# EAGLE design schem2 (EAGLE 9.6.2)
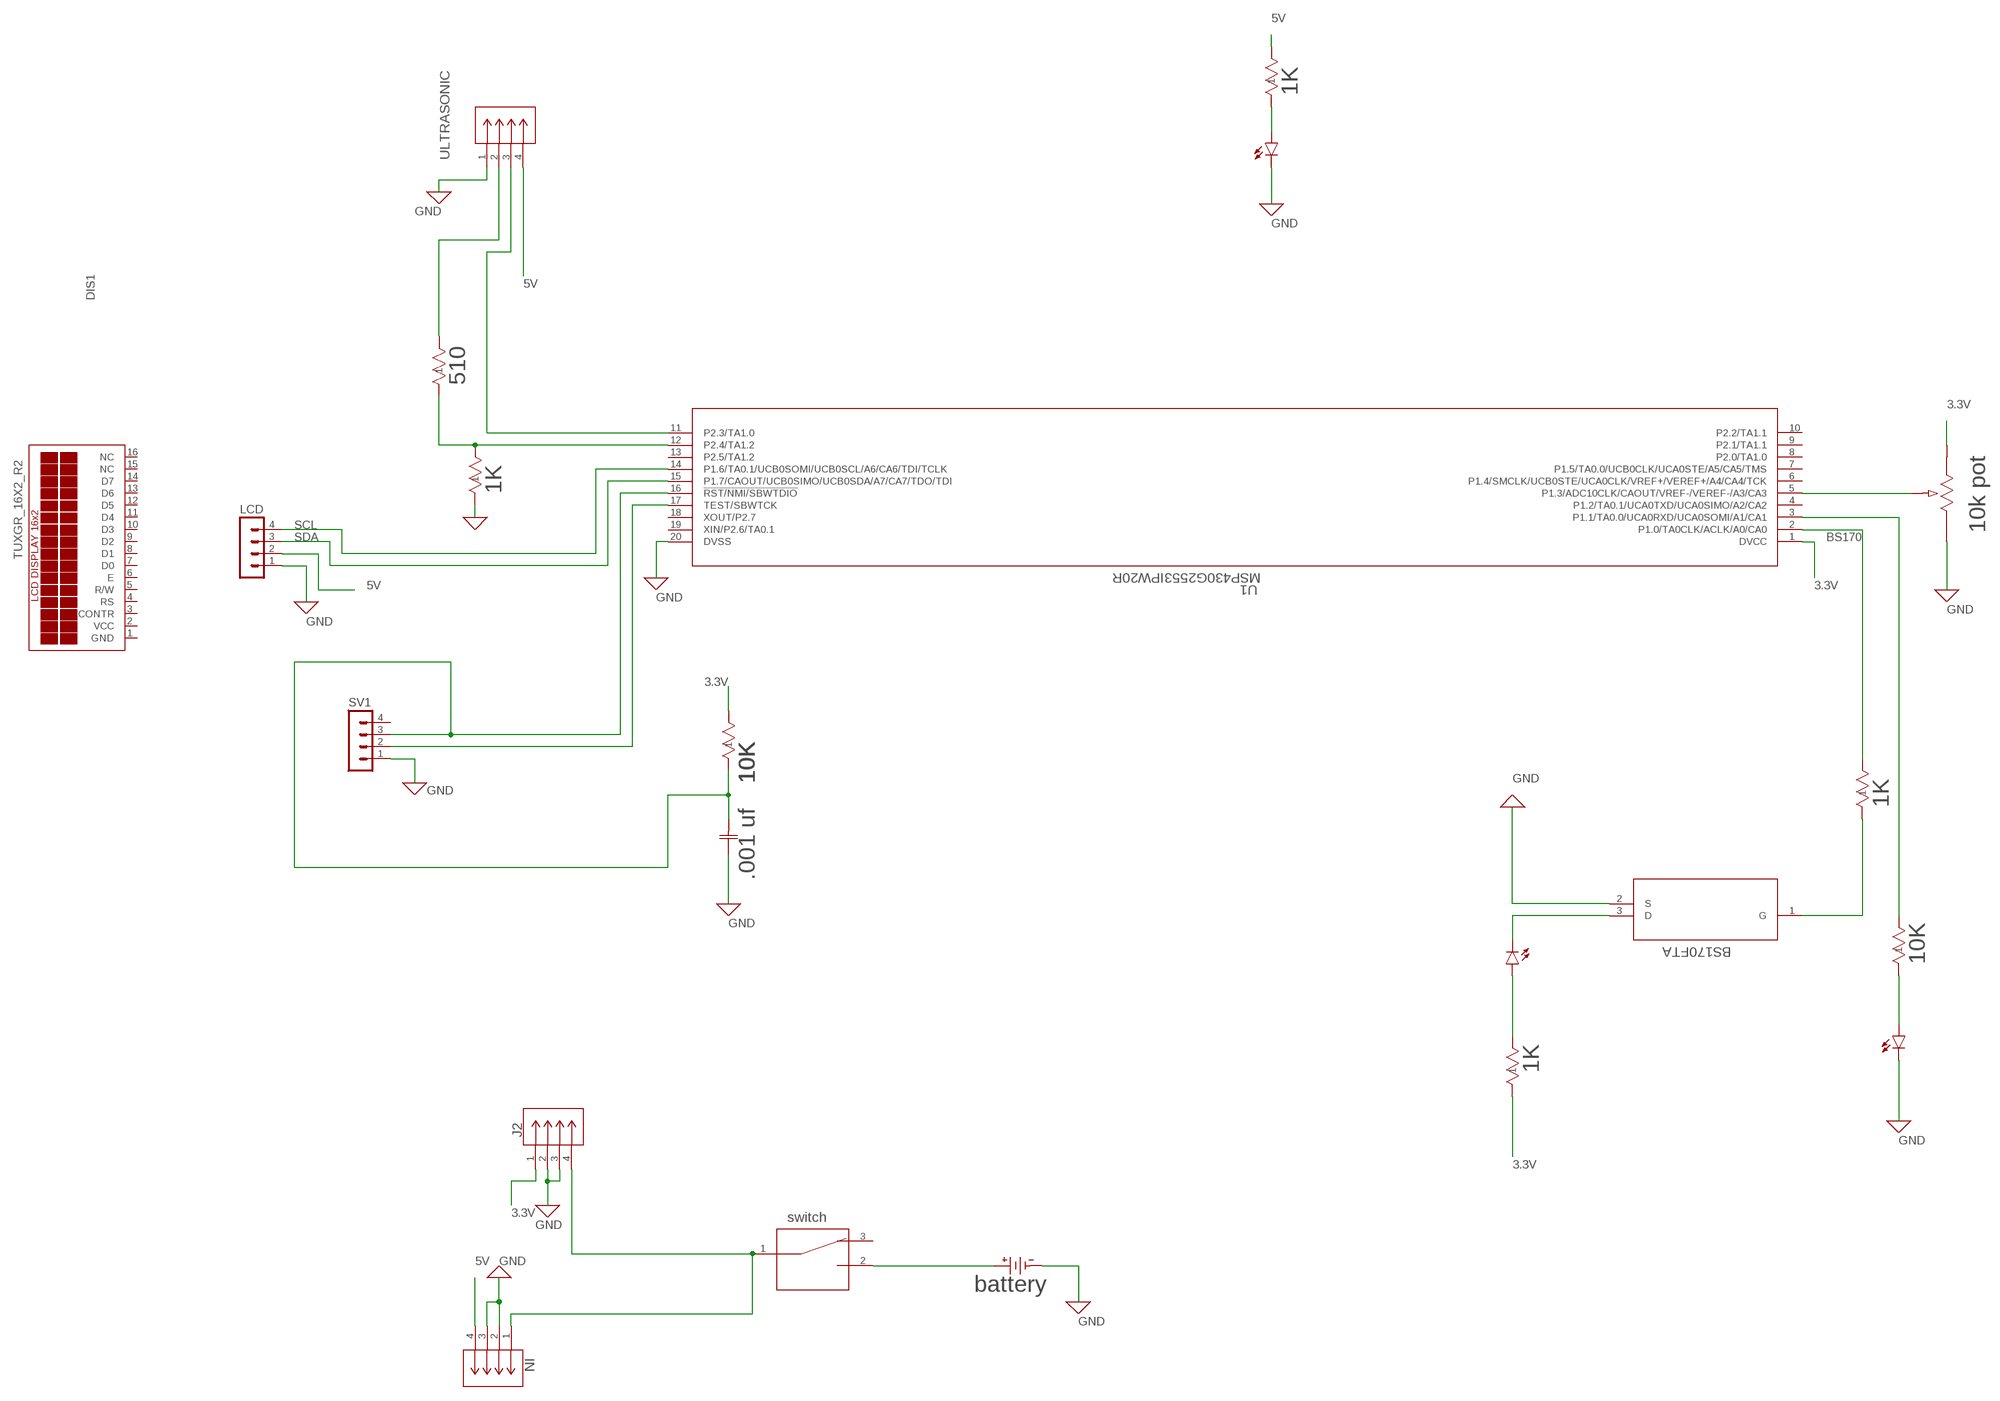
[diagram p0: schematic, sheet 1]

## Parts
B1  battery  2462RB  [2462RB_KEY]
C1  .001 uf  1206B473K500CT  [CAP_1206_B_WAL]
DIS1  TUXGR_16X2_R2  [TUXGR_16X2_R2]
IN  SSW-104-01-T-S  [CON4_1X4_TU_SSQ]
J2  SSW-104-01-T-S  [CON4_1X4_TU_SSQ]
LCD  MA04-1  [MA04-1]
LED1  LEDCHIPLED_0805  [CHIPLED_0805]
LED2  LEDCHIPLED_0805  [CHIPLED_0805]
LED5R  LEDCHIPLED_0805  [CHIPLED_0805]
R1  510  RMCF1206JT510R  [STA_RMCF1206_STP]
R2  10K  RC1206FR-0710KL  [RC1206N_YAG]
R3  1K  RC1206FR-071KL  [RES_RC1206_YAG]
R4  10k pot  3362P-1-103LF  [POT_3362P]
R5REG  1K  RC1206FR-071KL  [RES_RC1206_YAG]
R6  1K  RC1206FR-071KL  [RES_RC1206_YAG]
R7  1K  RC1206FR-071KL  [RES_RC1206_YAG]
R8  10K  RC1206FR-0710KL  [RC1206N_YAG]
SV1  MA04-1  [MA04-1]
SW1  switch  09.03201.02  [09.03201_EAO]
U1  MSP430G2553IPW20R  [PW20]
U$1  BS170FTA  [SOT-23_DIO]
ULTRASONIC  SSW-104-01-T-S  [CON4_1X4_TU_SSQ]

## Nets
0: R3.1 ; supply symbol labelled GND
3.3V: J2.1 R2.2 R4.3 R6.1 U1.1(DVCC)
5V: IN.4 LCD.2 R5REG.2 ULTRASONIC.4
_: B1.2 SW1.2
BS170: R7.2 U1.2(P1.0/TA0CLK/ACLK/A0/CA0)
GND: B1.1 C1.1 IN.2 IN.3 J2.2 J2.3 LCD.1 LED2.C LED5R.C R4.1 SV1.1 U1.20(DVSS) U$1.2(S) ULTRASONIC.1
IN: IN.1 J2.4 SW1.1
N$1: U1.11(P2.3/TA1.0) ULTRASONIC.3
N$2: R1.1 R3.2 U1.12(P2.4/TA1.2)
N$3: R1.2 ULTRASONIC.2
N$4: R4.2 U1.5(P1.3/ADC10CLK/CAOUT/VREF-/VEREF-/A3/CA3)
N$8: R7.1 U$1.1(G)
N$9: LED1.C U$1.3(D)
N$10: LED1.A R6.2
N$13: R8.2 U1.3(P1.1/TA0.0/UCA0RXD/UCA0SOMI/A1/CA1)
N$14: LED2.A R8.1
N$16: SV1.2 U1.17(TEST/SBWTCK)
N$17: C1.2 R2.1 SV1.3 U1.16(!RST/NMI/SBWTDIO)
N$25: LED5R.A R5REG.1
SCL: LCD.4 U1.14(P1.6/TA0.1/UCB0SOMI/UCB0SCL/A6/CA6/TDI/TCLK)
SDA: LCD.3 U1.15(P1.7/CAOUT/UCB0SIMO/UCB0SDA/A7/CA7/TDO/TDI)
Unconnected: DIS1.3(CONTR) DIS1.4(RS) DIS1.5(R/W) DIS1.6(E) DIS1.7(D0) DIS1.8(D1) DIS1.9(D2) DIS1.10(D3) DIS1.11(D4) DIS1.12(D5) DIS1.13(D6) DIS1.14(D7) DIS1.15(NC) DIS1.16(NC) SV1.4 SW1.3 U1.4(P1.2/TA0.1/UCA0TXD/UCA0SIMO/A2/CA2) U1.6(P1.4/SMCLK/UCB0STE/UCA0CLK/VREF+/VEREF+/A4/CA4/TCK) U1.7(P1.5/TA0.0/UCB0CLK/UCA0STE/A5/CA5/TMS) U1.8(P2.0/TA1.0) U1.9(P2.1/TA1.1) U1.10(P2.2/TA1.1) U1.13(P2.5/TA1.2) U1.18(XOUT/P2.7) U1.19(XIN/P2.6/TA0.1)

## Power pins joined to a net without a drawn wire
GND: DIS1.1(GND)
VCC: DIS1.2(VCC)

## Library data of the parts
B1 = lib2:2462RB; COPYRIGHT: Copyright (C) 2024 Ultra Librarian. All rights reserved.; MANUFACTURER_PART_NUMBER: 2462RB; MFR_NAME: Keystone Electronics
C1 = lib2:1206B473K500CT; COPYRIGHT: Copyright (C) 2024 Ultra Librarian. All rights reserved.; MANUFACTURER_PART_NUMBER: 1206B473K500CT; MFR_NAME: Walsin
DIS1 = display-lcd:TUXGR_16X2_R2: Tuxgraphics LCD display 16x2 characters reflective, without background light Source: tuxgr_12x2_r2.pdf; OC_FARNELL: unknown; OC_NEWARK: unknown
IN J2 ULTRASONIC = lib2:SSW-104-01-T-S; COPYRIGHT: Copyright (C) 2024 Ultra Librarian. All rights reserved.; MANUFACTURER_PART_NUMBER: SSW-104-01-T-S; MFR_NAME: Samtec Inc
LCD SV1 = con-lstb:MA04-1: PIN HEADER; OC_FARNELL: unknown; OC_NEWARK: unknown
LED1 LED2 LED5R = led:LED: LED OSRAM: - CHIPLED LG R971, LG N971, LY N971, LG Q971, LY Q971, LO R971, LY R971 LH N974, LH R974 LS Q976, LO Q976, LY Q976 LO Q996 - Hyper CHIPLED LW Q18S LB Q993, LB Q99A, LB R99A - SideLED LS A670, LO A670, LY A670, LG A670, LP A670 LB A673, LV A673, LT A673, LW A673 LH A674 LY A675 LS A676, LA A676, LO A676, LY A676, LW A676 LS A679, LY A679, LG A679 - Hyper Micro SIDELED® LS Y876, LA Y876, LO Y876, LY Y876 LT Y87S - SmartLED LW L88C, LW L88S LB L89C, LB L89S, LG L890 LS L89K, LO L89K, LY L89K LS L896, LA L896, LO L896, LY L896 - TOPLED LS T670, LO T670, LY T670, LG T670, LP T670 LSG T670, LSP T670, LSY T670, LOP T670, LYG T670 LG T671, LOG T671, LSG T671 LB T673, LV T673, LT T673, LW T673 LH T674 LS T676, LA T676, LO T676, LY T676, LB T676, LH T676, LSB T676, LW T676 LB T67C, LV T67C, LT T67C, LS T67K, LO T67K, LY T67K, LW E67C LS E67B, LA E67B, LO E67B, LY E67B, LB E67C, LV E67C, LT E67C LW T67C LS T679, LY T679, LG T679 LS T770, LO T770, LY T770, LG T770, LP T770 LB T773, LV T773, LT T773, LW T773 LH T774 LS E675, LA E675, LY E675, LS T675 LS T776, LA T776, LO T776, LY T776, LB T776 LHGB T686 LT T68C, LB T68C - Hyper Mini TOPLED® LB M676 - Mini TOPLED Santana® LG M470 LS M47K, LO M47K, LY M47K Source: http://www.osram.convergy.de LUXEON: - LUMILED® LXK2-PW12-R00, LXK2-PW12-S00, LXK2-PW14-U00, LXK2-PW14-V00 LXK2-PM12-R00, LXK2-PM12-S00, LXK2-PM14-U00 LXK2-PE12-Q00, LXK2-PE12-R00, LXK2-PE12-S00, LXK2-PE14-T00, LXK2-PE14-U00 LXK2-PB12-K00, LXK2-PB12-L00, LXK2-PB12-M00, LXK2-PB14-N00, LXK2-PB14-P00, LXK2-PB14-Q00 LXK2-PR12-L00, LXK2-PR12-M00, LXK2-PR14-Q00, LXK2-PR14-R00 LXK2-PD12-Q00, LXK2-PD12-R00, LXK2-PD12-S00 LXK2-PH12-R00, LXK2-PH12-S00 LXK2-PL12-P00, LXK2-PL12-Q00, LXK2-PL12-R00 Source: www.luxeon.com KINGBRIGHT: KA-3528ASYC Source: www.kingbright.com
R1 = lib2:RMCF1206JT510R; COPYRIGHT: Copyright (C) 2024 Ultra Librarian. All rights reserved.; MANUFACTURER_PART_NUMBER: RMCF1206JT510R; MFR_NAME: Stackpole International
R2 R8 = lib2:RC1206FR-0710KL; COPYRIGHT: Copyright (C) 2024 Ultra Librarian. All rights reserved.; MANUFACTURER_PART_NUMBER: RC1206FR-0710KL; MFR_NAME: Yageo
R3 R5REG R6 R7 = lib2:RC1206FR-071KL; COPYRIGHT: Copyright (C) 2024 Ultra Librarian. All rights reserved.; MANUFACTURER_PART_NUMBER: RC1206FR-071KL; MFR_NAME: Yageo
R4 = lib2:3362P-1-103LF; COPYRIGHT: Copyright (C) 2024 Ultra Librarian. All rights reserved.; MANUFACTURER_PART_NUMBER: 3362P-1-103LF; MFR_NAME: Bourns Electronics
SW1 = lib2:09.03201.02; COPYRIGHT: Copyright (C) 2024 Ultra Librarian. All rights reserved.; MANUFACTURER_PART_NUMBER: 09.03201.02; MFR_NAME: EAO; TYPE: Slide Switches
U1 = lib2:MSP430G2553IPW20R; COPYRIGHT: Copyright (C) 2024 Ultra Librarian. All rights reserved.; MANUFACTURER_PART_NUMBER: MSP430G2553IPW20R; MFR_NAME: Texas Instruments
U$1 = lib2:BS170FTA

## Board
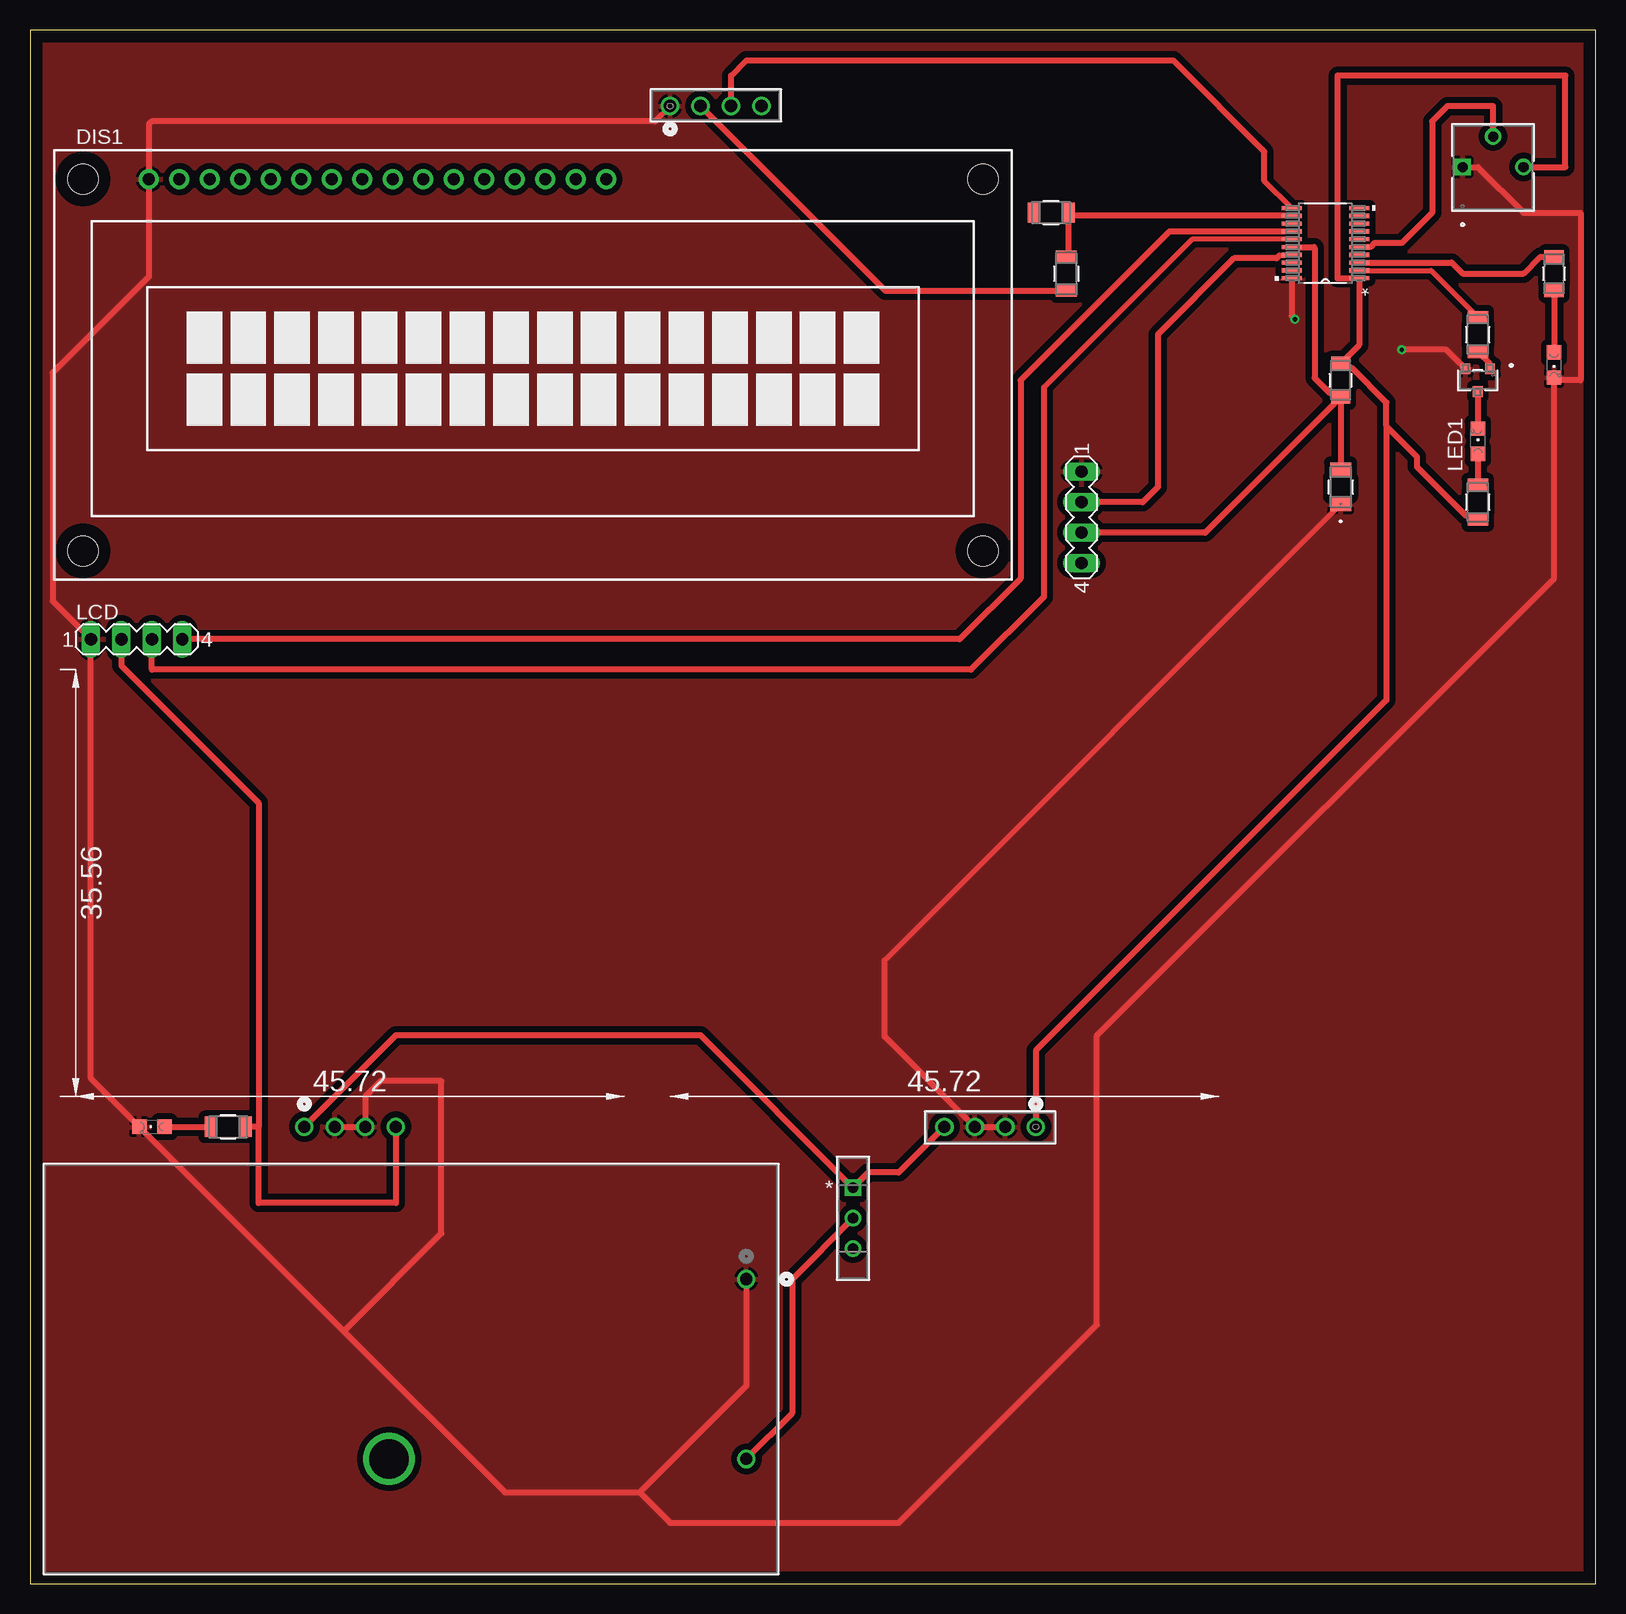
[diagram p1: board, top side]
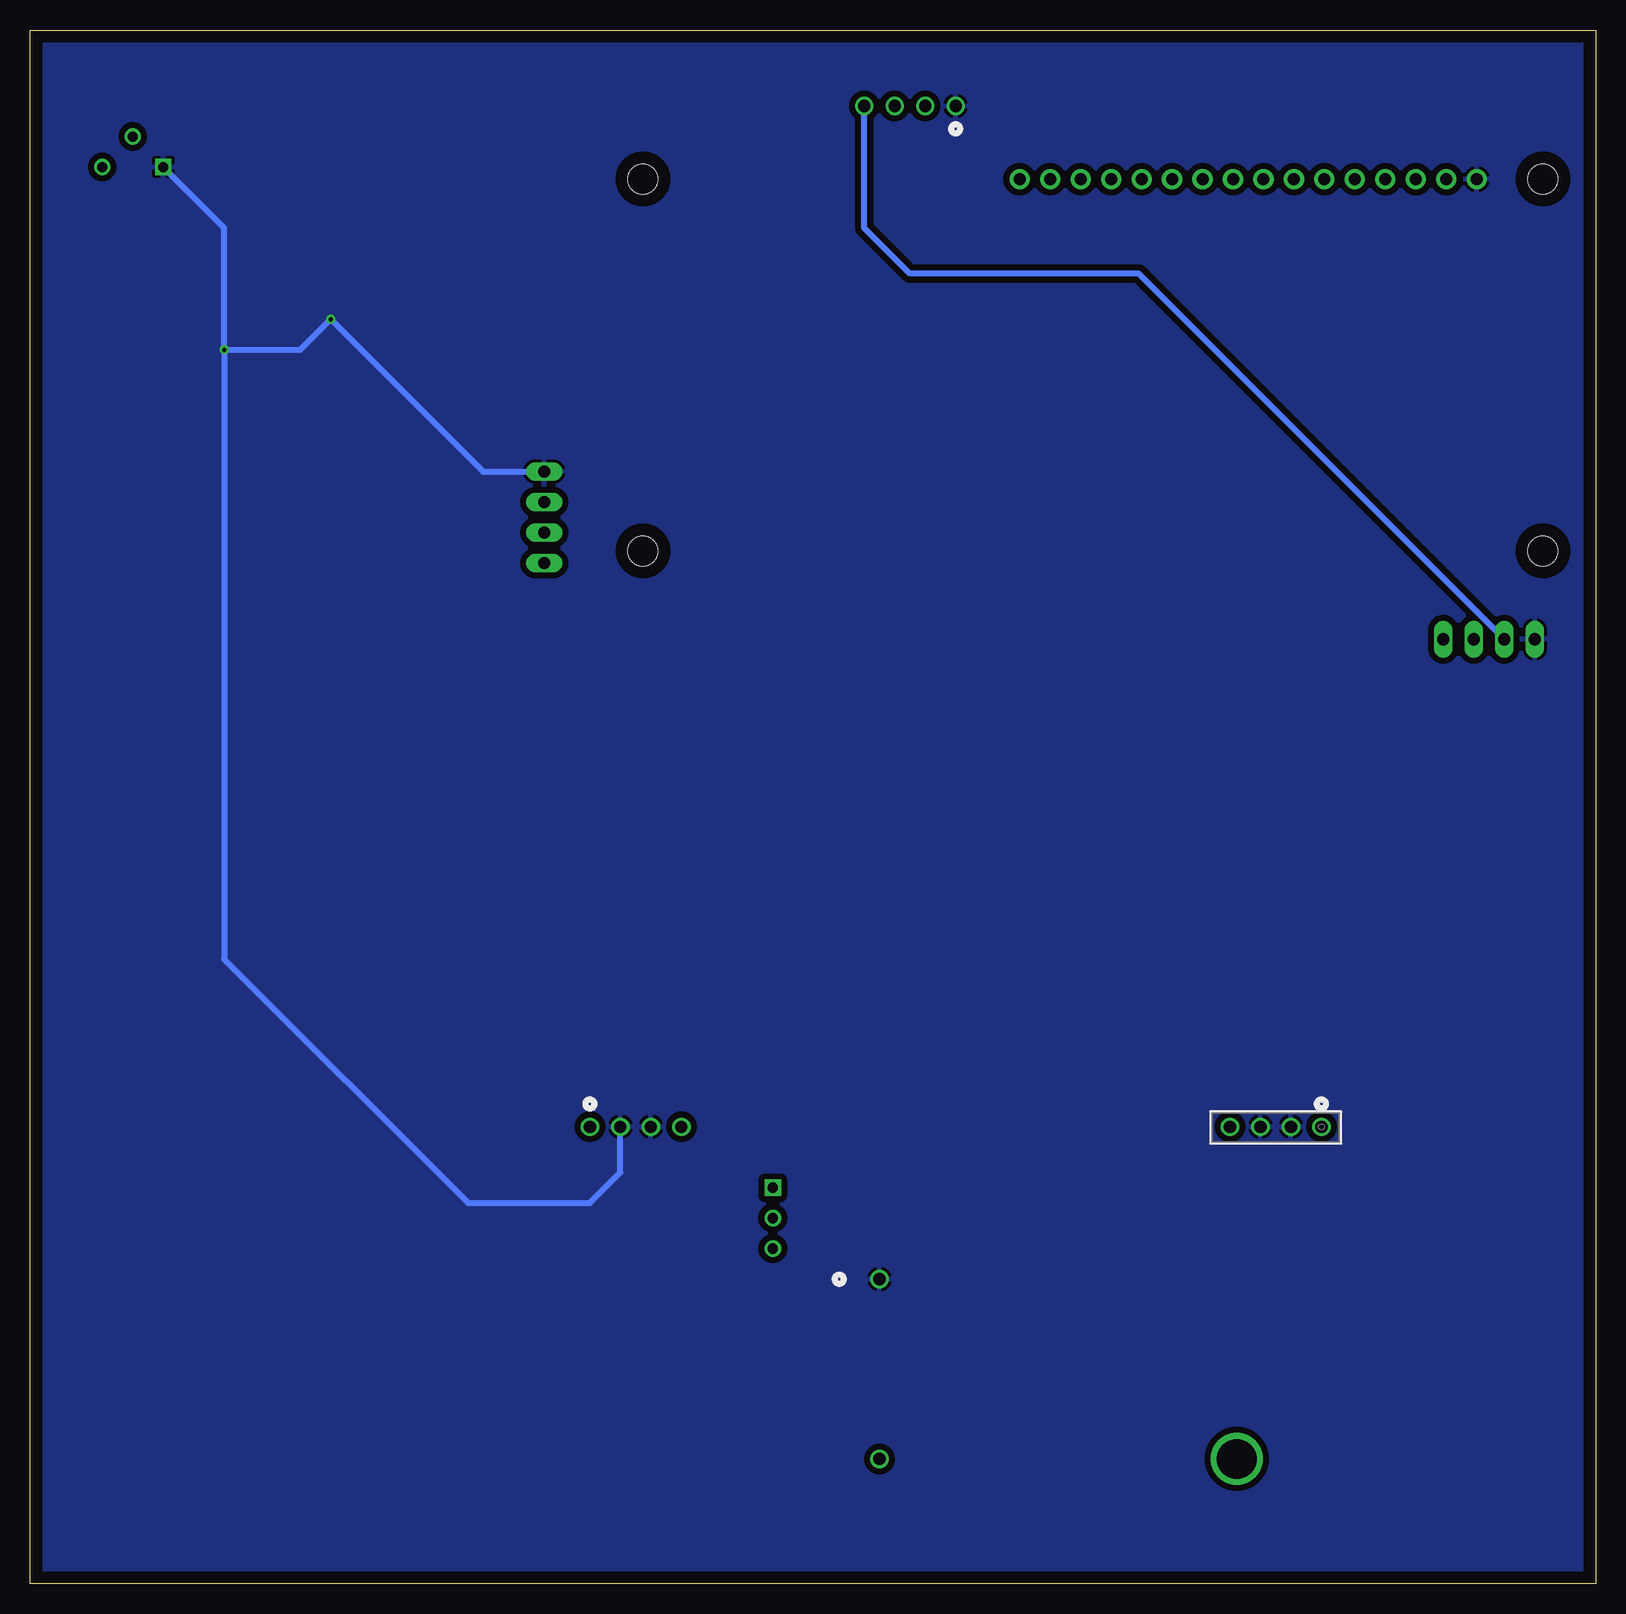
[diagram p2: board, bottom side, seen from below]

Size 130.48 x 129.53 mm. Coordinates in mm from the lower left corner, seen from the top.
Outline: 0,0 130.48,0 130.48,129.53 0,129.53 0,0
Copper layers (1*16): Top 0.035mm / dielectric 1.5mm / Bottom 0.035mm
Design rules "default": minimum track width 6mil, minimum drill 0.35mm, track to track 6mil, track to pad 6mil, pad to pad 6mil, via to via 6mil, smd to smd 6mil, copper to edge 40mil, drill to drill 6mil, minimum pad ring 10mil, minimum via ring 8mil, stop-mask expansion 4mil, vias tented up to drill 0mil, thermal gap 10mil

### Footprints (pad centres in the part's own frame; a part is rotated, then mirrored left to right if it is on the bottom)
2462RB_KEY = drill 1.016 pad 1.524: 1 0,0; 2 0,-14.986 | drill 3.302 pad 3.81: 3 -29.769,-14.986
CAP_1206_B_WAL = smd 1.168 x 1.753: 1 -1.448,0; 2 1.448,0
TUXGR_16X2_R2 = drill 1 pad 1.676: 1 -32,15.5; 2 -29.46,15.5; 3 -26.92,15.5; 4 -24.38,15.5; 5 -21.84,15.5; 6 -19.3,15.5; 7 -16.76,15.5; 8 -14.22,15.5; 9 -11.68,15.5; 10 -9.14,15.5; 11 -6.6,15.5; 12 -4.06,15.5; 13 -1.52,15.5; 14 1.02,15.5; 15 3.56,15.5; 16 6.1,15.5 | hole 2.5: -37.5,-15.5; 37.5,-15.5; -37.5,15.5; 37.5,15.5
CON4_1X4_TU_SSQ = drill 1.016 pad 1.524: 1 -3.81,0; 2 -1.27,0; 3 1.27,0; 4 3.81,0
MA04-1 = drill 1.016 long: 1 -3.81,0; 2 -1.27,0; 3 1.27,0; 4 3.81,0
CHIPLED_0805 = smd 1.2 x 1.2: A 0,-1.05; C 0,1.05
STA_RMCF1206_STP = smd 1.016 x 1.753: 1 -1.422,0; 2 1.422,0
RC1206N_YAG = smd 1.118 x 1.6: 1 -1.397,0; 2 1.397,0
RES_RC1206_YAG = smd 1.016 x 1.702: 1 -1.448,0; 2 1.448,0
POT_3362P = drill 0.838 pad 1.346 square: 1 0,0 | drill 0.838 pad 1.346: 2 2.54,2.54; 3 5.08,0
09.03201_EAO = drill 0.864 pad 1.372 square: 1 0,0 | drill 0.864 pad 1.372: 2 0,-2.54; 3 0,-5.08
PW20 = smd 1.676 x 0.356: 1 -2.819,2.925; 2 -2.819,2.275; 3 -2.819,1.625; 4 -2.819,0.975; 5 -2.819,0.325; 6 -2.819,-0.325; 7 -2.819,-0.975; 8 -2.819,-1.625; 9 -2.819,-2.275; 10 -2.819,-2.925; 11 2.819,-2.925; 12 2.819,-2.275; 13 2.819,-1.625; 14 2.819,-0.975; 15 2.819,-0.325; 16 2.819,0.325; 17 2.819,0.975; 18 2.819,1.625; 19 2.819,2.275; 20 2.819,2.925
SOT-23_DIO = smd 0.813 x 0.889: 1 -1.025,-0.945; 2 1.025,-0.945; 3 0,0.945

### Placement (x,y rotation side)
B1  59.69,25.4 0 top
C1  109.22,91.44 90 top
DIS1  41.91,101.6 0 top
IN  26.67,38.1 180 bottom
J2  80.01,38.1 180 top
LCD  8.89,78.74 0 top
LED1  120.65,95.25 0 top
LED2  127,101.6 180 top
LED5R  10.16,38.1 90 top
R1  86.36,109.22 270 top
R2  109.22,100.33 90 top
R3  85.09,114.3 0 top
R4  119.38,118.11 0 top
R5REG  16.51,38.1 0 top
R6  120.65,90.17 90 top
R7  120.65,104.14 90 top
R8  127,109.22 90 top
SV1  87.63,88.9 270 top
SW1  68.58,33.02 0 top
U1  107.95,111.76 180 top
U$1  120.65,100.33 180 top
ULTRASONIC  57.15,123.19 0 top

### Tracks (layer width: path | path; a pad name or v marks a point on that pad's centre or on a via)
3.3V
  Top 0.508: U1.1 110.77,108.82 | 110.77,108.82 110.77,103.28 R2.2 109.22,101.6 109.44,101.38 110.13,101.38 113.03,98.49 113.03,96.52 | 113.03,96.52 115.58,93.97 115.58,93.12 119.69,89.01 120.36,89.01 R6.1 | R4.3 127.94,118.11 127.94,125.73 108.97,125.73 108.97,108.82 110.77,108.82 | J2.1 83.82,44.45 113.03,73.66 113.03,96.52
5V
  Top 0.508: LCD.2 7.62,76.54 19.05,65.11 19.05,38.1 | 19.05,38.1 R5REG.2 | IN.4 30.48,31.75 19.05,31.75 19.05,38.1
  Bottom 0.508: LCD.2 38.1,109.22 57.15,109.22 60.96,113.03 ULTRASONIC.4
_
  Top 0.508: SW1.2 63.5,25.4 63.5,14.22 B1.2
BS170
  Top 0.406: U1.2 116.75,109.49 R7.2
GND  (via drill 0.35)
  Top 0.406: 71.21,51.98 C1.1
  Top 0.508: U1.20 105.13,105.69 v105.41,105.41 | U$1.2 118.03,102.87 v114.3,102.87 | R4.1 120.65,118.11 124.46,114.3 129.21,114.3 129.21,100.33 127.22,100.33 | 127.22,100.33 LED2.C | 127.22,100.33 127,100.33 127,83.82 88.9,45.72 88.9,21.59 72.39,5.08 53.34,5.08 50.8,7.62 | B1.1 59.69,16.51 50.8,7.62 | 26.14,21.06 LED5R.C 5.08,42.13 LCD.1 1.89,81.93 1.89,100.95 9.91,108.97 DIS1.1 9.91,121.67 10.16,121.92 52.07,121.92 ULTRASONIC.1 | 26.14,21.06 39.59,7.62 50.8,7.62 | J2.2 J2.3 71.21,45.63 71.21,51.98 | IN.2 IN.3 27.94,40.64 29.21,41.91 34.29,41.91 34.29,29.21 26.14,21.06
  Bottom 0.508: v114.3,102.87 107.95,102.87 v105.41,105.41 92.71,92.71 SV1.1 | v114.3,102.87 114.3,113.03 R4.1 | v114.3,102.87 114.3,52.07 93.98,31.75 83.82,31.75 81.28,34.29 J2.2
  pour Top (isolate 0.508): 0,129.54 130.81,129.54 130.81,0 0,0
  pour Bottom (isolate 0.508): 0,129.54 130.81,129.54 130.81,0 0,0
IN
  Top 0.508: J2.4 72.39,34.29 69.85,34.29 SW1.1 55.88,45.72 30.48,45.72 IN.1
N$1
  Top 0.406: U1.11 102.87,116.95
  Top 0.508: 102.87,116.95 102.87,119.38 95.25,127 59.69,127 58.42,125.73 ULTRASONIC.3
N$2
  Top 0.508: U1.12 86.8,114.03 R3.2 86.54,110.82 R1.1
N$3
  Top 0.508: ULTRASONIC.2 71.27,107.8 R1.2
N$4
  Top 0.508: R4.2 121.92,123.19 118.11,123.19 116.84,121.92 116.84,114.3 114.3,111.76 112.03,111.76 111.71,111.44 U1.5
N$8
  Top 0.508: R7.1 121.68,101.67 U$1.1
N$9
  Top 0.508: U$1.3 LED1.C
N$10
  Top 0.508: LED1.A R6.2
N$13
  Top 0.508: U1.3 118.47,110.13 119.38,109.22 124.46,109.22 125.86,110.62 R8.2
N$14
  Top 0.508: R8.1 LED2.A
N$16
  Top 0.406: U1.17 105.06,110.72 104.12,110.72
  Top 0.508: 104.12,110.72 103.9,110.49 100.33,110.49 93.98,104.14 93.98,91.44 92.71,90.17 SV1.2
N$17
  Top 0.508: R2.1 C1.2 | U1.16 107,111.44 107.06,111.38 107.06,100.52 108.31,99.28 108.88,99.28 R2.1 | R2.1 97.92,87.63 SV1.3
N$25
  Top 0.508: LED5R.A R5REG.1
SCL
  Top 0.508: U1.14 94.96,112.74 82.55,100.33 82.55,83.82 77.47,78.74 LCD.4
SDA
  Top 0.406: U1.15 96.84,112.09 84.48,99.72
  Top 0.508: 84.48,99.72 84.48,82.28 78.4,76.2 10.16,76.2 LCD.3